# Altium schematic sheet 03_iMX 8X_PMIC.SchDoc
size A3; SheetNumber: 4; SheetTotal: 22
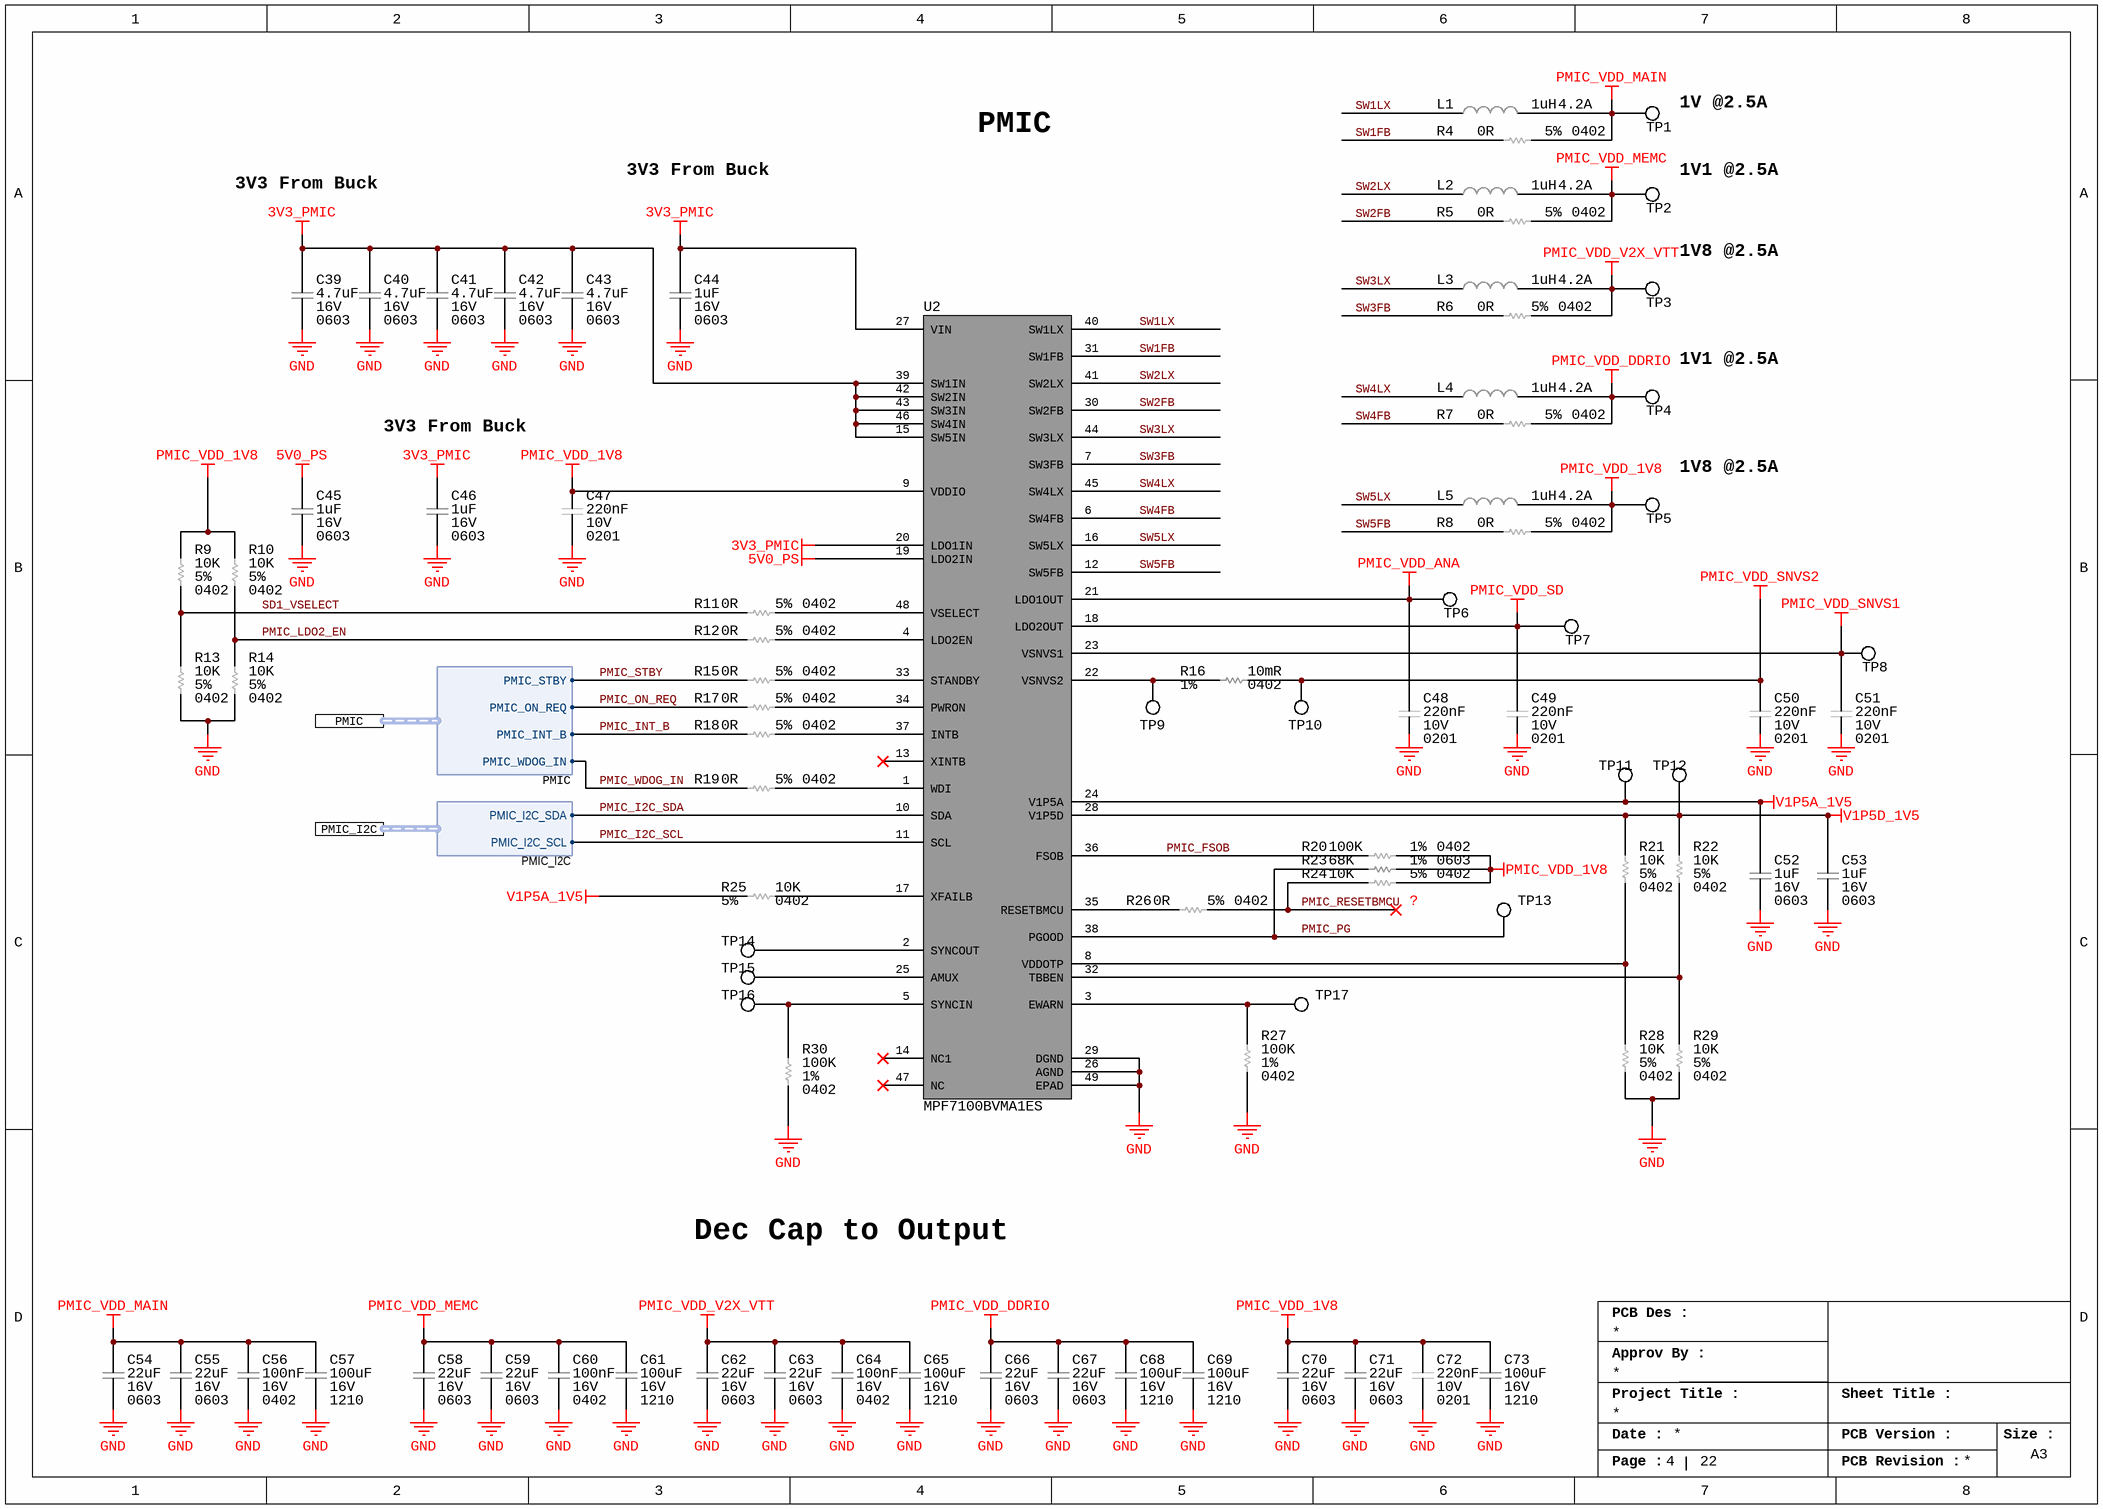
[diagram p0: 03_iMX 8X_PMIC.SchDoc]

## Parts
C39  Voltage: 16V  Capacitance: 4.7uF  Case/Package: 0603  [CAP_0603_CAPC1608X08N]  (hidden comment: CL10A475KO8NNNC)
C40  Voltage: 16V  Capacitance: 4.7uF  Case/Package: 0603  [CAP_0603_CAPC1608X08N]  (hidden comment: CL10A475KO8NNNC)
C41  Voltage: 16V  Capacitance: 4.7uF  Case/Package: 0603  [CAP_0603_CAPC1608X08N]  (hidden comment: CL10A475KO8NNNC)
C42  Voltage: 16V  Capacitance: 4.7uF  Case/Package: 0603  [CAP_0603_CAPC1608X08N]  (hidden comment: CL10A475KO8NNNC)
C43  Voltage: 16V  Capacitance: 4.7uF  Case/Package: 0603  [CAP_0603_CAPC1608X08N]  (hidden comment: CL10A475KO8NNNC)
C44  Voltage Rating: 16V  Capacitance: 1uF  Case/Package: 0603  [CAP_0603_CAPC1608X08N]  (hidden comment: CL10A105KO8NNNC)
C45  Voltage Rating: 16V  Capacitance: 1uF  Case/Package: 0603  [CAP_0603_CAPC1608X08N]  (hidden comment: CL10A105KO8NNNC)
C46  Voltage Rating: 16V  Capacitance: 1uF  Case/Package: 0603  [CAP_0603_CAPC1608X08N]  (hidden comment: CL10A105KO8NNNC)
C47  Voltage Rating (DC): 10V  Capacitance: 220nF  Case/Package: 0201  [CAP_0201_CAPC0603X03N]  (hidden comment: LMK063BJ224MP-F)
C48  Voltage Rating (DC): 10V  Capacitance: 220nF  Case/Package: 0201  [CAP_0201_CAPC0603X03N]  (hidden comment: LMK063BJ224MP-F)
C49  Voltage Rating (DC): 10V  Capacitance: 220nF  Case/Package: 0201  [CAP_0201_CAPC0603X03N]  (hidden comment: LMK063BJ224MP-F)
C50  Voltage Rating (DC): 10V  Capacitance: 220nF  Case/Package: 0201  [CAP_0201_CAPC0603X03N]  (hidden comment: LMK063BJ224MP-F)
C51  Voltage Rating (DC): 10V  Capacitance: 220nF  Case/Package: 0201  [CAP_0201_CAPC0603X03N]  (hidden comment: LMK063BJ224MP-F)
C52  Voltage Rating: 16V  Capacitance: 1uF  Case/Package: 0603  [CAP_0603_CAPC1608X08N]  (hidden comment: CL10A105KO8NNNC)
C53  Voltage Rating: 16V  Capacitance: 1uF  Case/Package: 0603  [CAP_0603_CAPC1608X08N]  (hidden comment: CL10A105KO8NNNC)
C54  Capacitance: 22uF  Voltage Rating: 16V  Case/Package: 0603  [CAP_0603_CAPC1608X08N]  (hidden comment: CL10A226MO7JZNC)
C55  Capacitance: 22uF  Voltage Rating: 16V  Case/Package: 0603  [CAP_0603_CAPC1608X08N]  (hidden comment: CL10A226MO7JZNC)
C56  Voltage Rating: 16V  Capacitance: 100nF  Case/Package: 0402  [CAP_0402_CAPC1005X05N]  (hidden comment: CL05B104KO5NNNC)
C57  Voltage Rating: 16V  Capacitance: 100uF  Case/Package: 1210  [CAP_1210_CAPC3225X270N]  (hidden comment: EMK325ABJ107MM-T)
C58  Capacitance: 22uF  Voltage Rating: 16V  Case/Package: 0603  [CAP_0603_CAPC1608X08N]  (hidden comment: CL10A226MO7JZNC)
C59  Capacitance: 22uF  Voltage Rating: 16V  Case/Package: 0603  [CAP_0603_CAPC1608X08N]  (hidden comment: CL10A226MO7JZNC)
C60  Voltage Rating: 16V  Capacitance: 100nF  Case/Package: 0402  [CAP_0402_CAPC1005X05N]  (hidden comment: CL05B104KO5NNNC)
C61  Voltage Rating: 16V  Capacitance: 100uF  Case/Package: 1210  [CAP_1210_CAPC3225X270N]  (hidden comment: EMK325ABJ107MM-T)
C62  Capacitance: 22uF  Voltage Rating: 16V  Case/Package: 0603  [CAP_0603_CAPC1608X08N]  (hidden comment: CL10A226MO7JZNC)
C63  Capacitance: 22uF  Voltage Rating: 16V  Case/Package: 0603  [CAP_0603_CAPC1608X08N]  (hidden comment: CL10A226MO7JZNC)
C64  Voltage Rating: 16V  Capacitance: 100nF  Case/Package: 0402  [CAP_0402_CAPC1005X05N]  (hidden comment: CL05B104KO5NNNC)
C65  Voltage Rating: 16V  Capacitance: 100uF  Case/Package: 1210  [CAP_1210_CAPC3225X270N]  (hidden comment: EMK325ABJ107MM-T)
C66  Capacitance: 22uF  Voltage Rating: 16V  Case/Package: 0603  [CAP_0603_CAPC1608X08N]  (hidden comment: CL10A226MO7JZNC)
C67  Capacitance: 22uF  Voltage Rating: 16V  Case/Package: 0603  [CAP_0603_CAPC1608X08N]  (hidden comment: CL10A226MO7JZNC)
C68  Voltage Rating: 16V  Capacitance: 100uF  Case/Package: 1210  [CAP_1210_CAPC3225X270N]  (hidden comment: EMK325ABJ107MM-T)
C69  Voltage Rating: 16V  Capacitance: 100uF  Case/Package: 1210  [CAP_1210_CAPC3225X270N]  (hidden comment: EMK325ABJ107MM-T)
C70  Capacitance: 22uF  Voltage Rating: 16V  Case/Package: 0603  [CAP_0603_CAPC1608X08N]  (hidden comment: CL10A226MO7JZNC)
C71  Capacitance: 22uF  Voltage Rating: 16V  Case/Package: 0603  [CAP_0603_CAPC1608X08N]  (hidden comment: CL10A226MO7JZNC)
C72  Voltage Rating (DC): 10V  Capacitance: 220nF  Case/Package: 0201  [CAP_0201_CAPC0603X03N]  (hidden comment: LMK063BJ224MP-F)
C73  Voltage Rating: 16V  Capacitance: 100uF  Case/Package: 1210  [CAP_1210_CAPC3225X270N]  (hidden comment: EMK325ABJ107MM-T)
L1  Saturation Current: 4.2A  Inductance: 1uH  [INDC2520X120N]  (hidden comment: TFM252012ALMA1R0MTAA)
L2  Saturation Current: 4.2A  Inductance: 1uH  [INDC2520X120N]  (hidden comment: TFM252012ALMA1R0MTAA)
L3  Saturation Current: 4.2A  Inductance: 1uH  [INDC2520X120N]  (hidden comment: TFM252012ALMA1R0MTAA)
L4  Saturation Current: 4.2A  Inductance: 1uH  [INDC2520X120N]  (hidden comment: TFM252012ALMA1R0MTAA)
L5  Saturation Current: 4.2A  Inductance: 1uH  [INDC2520X120N]  (hidden comment: TFM252012ALMA1R0MTAA)
R4  Case Code (Imperial): 0402  Tolerance: 5%  Resistance: 0R  [RES_0402_RESC1005X04N]  (hidden comment: ERJ-2GE0R00X)
R5  Case Code (Imperial): 0402  Tolerance: 5%  Resistance: 0R  [RES_0402_RESC1005X04N]  (hidden comment: ERJ-2GE0R00X)
R6  Case Code (Imperial): 0402  Tolerance: 5%  Resistance: 0R  [RES_0402_RESC1005X04N]  (hidden comment: ERJ-2GE0R00X)
R7  Case Code (Imperial): 0402  Tolerance: 5%  Resistance: 0R  [RES_0402_RESC1005X04N]  (hidden comment: ERJ-2GE0R00X)
R8  Case Code (Imperial): 0402  Tolerance: 5%  Resistance: 0R  [RES_0402_RESC1005X04N]  (hidden comment: ERJ-2GE0R00X)
R9  Tolerance: 5%  Resistance: 10K  Case/Package: 0402  [RES_0402_RESC1005X04N]  (hidden comment: ERJ-2GEJ103X)
R10  Tolerance: 5%  Resistance: 10K  Case/Package: 0402  [RES_0402_RESC1005X04N]  (hidden comment: ERJ-2GEJ103X)
R11  Case Code (Imperial): 0402  Tolerance: 5%  Resistance: 0R  [RES_0402_RESC1005X04N]  (hidden comment: ERJ-2GE0R00X)
R12  Case Code (Imperial): 0402  Tolerance: 5%  Resistance: 0R  [RES_0402_RESC1005X04N]  (hidden comment: ERJ-2GE0R00X)
R13  Tolerance: 5%  Resistance: 10K  Case/Package: 0402  [RES_0402_RESC1005X04N]  (hidden comment: ERJ-2GEJ103X)
R14  Tolerance: 5%  Resistance: 10K  Case/Package: 0402  [RES_0402_RESC1005X04N]  (hidden comment: ERJ-2GEJ103X)
R15  Case Code (Imperial): 0402  Tolerance: 5%  Resistance: 0R  [RES_0402_RESC1005X04N]  (hidden comment: ERJ-2GE0R00X)
R16  Tolerance: 1%  Resistance: 10mR  Case/Package: 0402  [RES_0603_RESC1608X04N]  (hidden comment: ERJ-2LWFR010X)
R17  Case Code (Imperial): 0402  Tolerance: 5%  Resistance: 0R  [RES_0402_RESC1005X04N]  (hidden comment: ERJ-2GE0R00X)
R18  Case Code (Imperial): 0402  Tolerance: 5%  Resistance: 0R  [RES_0402_RESC1005X04N]  (hidden comment: ERJ-2GE0R00X)
R19  Case Code (Imperial): 0402  Tolerance: 5%  Resistance: 0R  [RES_0402_RESC1005X04N]  (hidden comment: ERJ-2GE0R00X)
R20  Resistance: 100K  Tolerance: 1%  Case/Package: 0402  [RES_0402_RESC1005X04N]  (hidden comment: RC0402FR-07100KL)
R21  Tolerance: 5%  Resistance: 10K  Case/Package: 0402  [RES_0402_RESC1005X04N]  (hidden comment: ERJ-2GEJ103X)
R22  Tolerance: 5%  Resistance: 10K  Case/Package: 0402  [RES_0402_RESC1005X04N]  (hidden comment: ERJ-2GEJ103X)
R23  Tolerance: 1%  Resistance: 68K  Case/Package: 0603  [RES_0603_RESC1608X04N]  (hidden comment: RC0603FR-0768KL)
R24  Tolerance: 5%  Resistance: 10K  Case/Package: 0402  [RES_0402_RESC1005X04N]  (hidden comment: ERJ-2GEJ103X)
R25  Tolerance: 5%  Resistance: 10K  Case/Package: 0402  [RES_0402_RESC1005X04N]  (hidden comment: ERJ-2GEJ103X)
R26  Case Code (Imperial): 0402  Tolerance: 5%  Resistance: 0R  [RES_0402_RESC1005X04N]  (hidden comment: ERJ-2GE0R00X)
R27  Resistance: 100K  Tolerance: 1%  Case/Package: 0402  [RES_0402_RESC1005X04N]  (hidden comment: RC0402FR-07100KL)
R28  Tolerance: 5%  Resistance: 10K  Case/Package: 0402  [RES_0402_RESC1005X04N]  (hidden comment: ERJ-2GEJ103X)
R29  Tolerance: 5%  Resistance: 10K  Case/Package: 0402  [RES_0402_RESC1005X04N]  (hidden comment: ERJ-2GEJ103X)
R30  Resistance: 100K  Tolerance: 1%  Case/Package: 0402  [RES_0402_RESC1005X04N]  (hidden comment: RC0402FR-07100KL)
TP1  NO COMPONENT  [TP_PAD_0.5MM_SMD_ROUND]  (value not drawn)  (no BOM)
TP2  NO COMPONENT  [TP_PAD_0.5MM_SMD_ROUND]  (value not drawn)  (no BOM)
TP3  NO COMPONENT  [TP_PAD_0.5MM_SMD_ROUND]  (value not drawn)  (no BOM)
TP4  NO COMPONENT  [TP_PAD_0.5MM_SMD_ROUND]  (value not drawn)  (no BOM)
TP5  NO COMPONENT  [TP_PAD_0.5MM_SMD_ROUND]  (value not drawn)  (no BOM)
TP6  NO COMPONENT  [TP_PAD_0.5MM_SMD_ROUND]  (value not drawn)  (no BOM)
TP7  NO COMPONENT  [TP_PAD_0.5MM_SMD_ROUND]  (value not drawn)  (no BOM)
TP8  NO COMPONENT  [TP_PAD_0.5MM_SMD_ROUND]  (value not drawn)  (no BOM)
TP9  NO COMPONENT  [TP_PAD_0.5MM_SMD_ROUND]  (value not drawn)  (no BOM)
TP10  NO COMPONENT  [TP_PAD_0.5MM_SMD_ROUND]  (value not drawn)  (no BOM)
TP11  NO COMPONENT  [TP_PAD_0.5MM_SMD_ROUND]  (value not drawn)  (no BOM)
TP12  NO COMPONENT  [TP_PAD_0.5MM_SMD_ROUND]  (value not drawn)  (no BOM)
TP13  NO COMPONENT  [TP_PAD_0.5MM_SMD_ROUND]  (value not drawn)  (no BOM)
TP14  NO COMPONENT  [TP_PAD_0.5MM_SMD_ROUND]  (value not drawn)  (no BOM)
TP15  NO COMPONENT  [TP_PAD_0.5MM_SMD_ROUND]  (value not drawn)  (no BOM)
TP16  NO COMPONENT  [TP_PAD_0.5MM_SMD_ROUND]  (value not drawn)  (no BOM)
TP17  NO COMPONENT  [TP_PAD_0.5MM_SMD_ROUND]  (value not drawn)  (no BOM)
U2  MPF7100BVMA1ES  [HVQFN48_SOT619-27D_NXP]

## Ports
PMIC (harness PMIC), PMIC_I2C (harness PMIC_I2C)

## Harnesses
PMIC_I2C: PMIC_I2C_SDA, PMIC_I2C_SCL
PMIC: PMIC_ON_REQ, PMIC_STBY, PMIC_INT_B, PMIC_WDOG_IN

## Nets
3V3_PMIC: C39.2 C40.2 C41.2 C42.2 C43.2 C44.2 C46.2 U2.15(SW5IN) U2.20(LDO1IN) U2.27(VIN) U2.39(SW1IN) U2.42(SW2IN) U2.43(SW3IN) U2.46(SW4IN)
5V0_PS: C45.2 U2.19(LDO2IN)
GND: C39.1 C40.1 C41.1 C42.1 C43.1 C44.1 C45.1 C46.1 C47.1 C48.1 C49.1 C50.1 C51.1 C52.1 C53.1 C54.1 C55.1 C56.1 C57.1 C58.1 C59.1 C60.1 C61.1 C62.1 C63.1 C64.1 C65.1 C66.1 C67.1 C68.1 C69.1 C70.1 C71.1 C72.1 C73.1 R13.1 R14.1 R27.1 R28.1 R29.1 R30.1 U2.26(AGND) U2.29(DGND) U2.49(EPAD)
PMIC_VDD_1V8: C47.2 C70.2 C71.2 C72.2 C73.2 L5.2 R8.2 R9.2 R10.2 R20.1 R23.2 R24.1 TP5.1 U2.9(VDDIO)
PMIC_VDD_ANA: C48.2 TP6.1 U2.21(LDO1OUT)
PMIC_VDD_DDRIO: C66.2 C67.2 C68.2 C69.2 L4.2 R7.2 TP4.1
PMIC_VDD_MAIN: C54.2 C55.2 C56.2 C57.2 L1.2 R4.2 TP1.1
PMIC_VDD_MEMC: C58.2 C59.2 C60.2 C61.2 L2.2 R5.2 TP2.1
PMIC_VDD_SD: C49.2 TP7.1 U2.18(LDO2OUT)
PMIC_VDD_SNVS1: C51.2 TP8.1 U2.23(VSNVS1)
PMIC_VDD_SNVS2: C50.2 R16.2 TP10.1
PMIC_VDD_V2X_VTT: C62.2 C63.2 C64.2 C65.2 L3.2 R6.2 TP3.1
V1P5A_1V5: C52.2 R25.2 TP11.1 U2.24(V1P5A)
V1P5D_1V5: C53.2 R21.2 R22.2 TP12.1 U2.28(V1P5D)
PMIC_FSOB: R20.2 U2.36(FSOB)
PMIC_I2C_SCL: U2.11(SCL) ; port PMIC_I2C.PMIC_I2C_SCL
PMIC_I2C_SDA: U2.10(SDA) ; port PMIC_I2C.PMIC_I2C_SDA
PMIC_INT_B: R18.1 ; port PMIC.PMIC_INT_B
PMIC_LDO2_EN: R10.1 R12.1 R14.2
PMIC_ON_REQ: R17.1 ; port PMIC.PMIC_ON_REQ
PMIC_PG: R23.1 TP13.1 U2.38(PGOOD)
PMIC_RESETBMCU: R24.2 R26.2
PMIC_STBY: R15.1 ; port PMIC.PMIC_STBY
PMIC_WDOG_IN: R19.1 ; port PMIC.PMIC_WDOG_IN
SD1_VSELECT: R9.1 R11.1 R13.2
SW1FB: R4.1 U2.31(SW1FB)
SW1LX: L1.1 U2.40(SW1LX)
SW2FB: R5.1 U2.30(SW2FB)
SW2LX: L2.1 U2.41(SW2LX)
SW3FB: R6.1 U2.7(SW3FB)
SW3LX: L3.1 U2.44(SW3LX)
SW4FB: R7.1 U2.6(SW4FB)
SW4LX: L4.1 U2.45(SW4LX)
SW5FB: R8.1 U2.12(SW5FB)
SW5LX: L5.1 U2.16(SW5LX)
NetR11_2: R11.2 U2.48(VSELECT)
NetR12_2: R12.2 U2.4(LDO2EN)
NetR15_2: R15.2 U2.33(STANDBY)
NetR16_1: R16.1 TP9.1 U2.22(VSNVS2)
NetR17_2: R17.2 U2.34(PWRON)
NetR18_2: R18.2 U2.37(INTB)
NetR19_2: R19.2 U2.1(WDI)
NetR21_1: R21.1 R28.2 U2.8(VDDOTP)
NetR22_1: R22.1 R29.2 U2.32(TBBEN)
NetR25_1: R25.1 U2.17(XFAILB)
NetR26_1: R26.1 U2.35(RESETBMCU)
NetR27_2: R27.2 TP17.1 U2.3(EWARN)
NetR30_2: R30.2 TP16.1 U2.5(SYNCIN)
NetTP14_1: TP14.1 U2.2(SYNCOUT)
NetTP15_1: TP15.1 U2.25(AMUX)

Not connected (* = marked no-connect by the designer): U2 13(XINTB)* 14(NC1)* 47(NC)*

## Notes on the sheet
- (near TP1) 1V @2.5A
- 3V3 From Buck
- PMIC
- 1V1 @2.5A
- 1V8 @2.5A
- (near TP4) 1V1 @2.5A
- (near TP5) 1V8 @2.5A
- ?
- Dec Cap to Output
- PCB Des :
- Approv By :
- Project Title :
- Sheet Title :
- Date :
- PCB Version :
- Size :
- A3
- Page :
- PCB Revision :

## Library data of the parts
C39-C43 = CAP_4.7UF_16V_X5R_0603: CAP CER 4.7UF 16V X5R 0603; Manufacturer: Samsung; Material: Ceramic; Tolerance: 10%; Supplier 1: Digi-Key; Manufacturer Part Number: CL10A475KO8NNNC; RoHS: Yes; Category: Ceramic Capacitors; Stock 1: 1197540; Pricing 1: 1=0.12, 10=0.084, 50=0.0476, 100=0.0394, 500=0.02764, 1000=0.02288 (USD); Mount: Surface Mount; Case Code (Metric): 1608; Case Code (Imperial): 0603; Min Operating Temperature: -55°C; Max Operating Temperature: 85°C; Packaging: Tape and Reel; Voltage Rating: 16V; Dielectric: X5R; Series: CL; Construction: Flat; Length: 1.6mm; Height: 0.8mm; Depth: 0.8mm; Radiation Hardening: No; RoHS Compliant: Yes; ComponentLink1URL: https://datasheet.ciiva.com/25795/cl10a475ko8nnnc-25795890.pdf?src-supplier=Digi-Key; ComponentLink1Description: https://datasheet.ciiva.com/25795/cl10a475ko8nnnc-25795890.pdf?src-supplier=Digi-Key; ComponentLink2URL: https://datasheet.ciiva.com/26838/getdatasheetpartid-358619-26838383.pdf?src-supplier=Verical; ComponentLink2Description: https://datasheet.ciiva.com/26838/getdatasheetpartid-358619-26838383.pdf?src-supplier=Verical; ComponentLink3URL: https://datasheet.ciiva.com/29198/457663-da-01-en-vs-kondensator-0603-29198671.pdf?src-supplier=Conrad; ComponentLink3Description: https://datasheet.ciiva.com/29198/457663-da-01-en-vs-kondensator-0603-29198671.pdf?src-supplier=Conrad; Supplier Part Number 1: 1276-1784-1-ND
C44-C46 C52 C53 = CAP_1UF_16V_X5R_0603: CAP CER 1UF 16V X5R 0603; Manufacturer: Samsung; Material: Ceramic; Tolerance: 10%; Manufacturer Part Number: CL10A105KO8NNNC; RoHS: Yes; Category: Ceramic Capacitors; Stock 1: 252255; Pricing 1: 1=0.10000, 10=0.03300, 50=0.01800, 100=0.01470, 500=0.01050, 1000=0.00825 (USD); Mount: Surface Mount; Case Code (Metric): 1608; Case Code (Imperial): 0603; Contact Plating: Tin; Min Operating Temperature: -55°C; Max Operating Temperature: 85°C; Package Quantity: 1; Packaging: Tape and Reel; Dielectric: X5R; Voltage Rating (DC): 16V; Series: CL; Voltage: 16V; Construction: Flat; Length: 1.6mm; Width: 0.031inch; Height: 0.8mm; Thickness: 0.035inch; Depth: 0.8mm; Radiation Hardening: No; Lead Free: Lead Free; RoHS Compliant: Yes; ComponentLink1URL: https://datasheet.ciiva.com/16199/cl10a105ko8nnnc-16199033.pdf?src-supplier=Future+Electronics; ComponentLink1Description: https://datasheet.ciiva.com/16199/cl10a105ko8nnnc-16199033.pdf?src-supplier=Future+Electronics; ComponentLink2URL: https://datasheet.ciiva.com/15195/getdatasheetpartid-359688-15195706.pdf?src-supplier=Verical; ComponentLink2Description: https://datasheet.ciiva.com/15195/getdatasheetpartid-359688-15195706.pdf?src-supplier=Verical; ComponentLink3URL: https://datasheet.ciiva.com/29198/458190-da-01-en-vs-kondensator-0603-29198480.pdf?src-supplier=Conrad; ComponentLink3Description: https://datasheet.ciiva.com/29198/458190-da-01-en-vs-kondensator-0603-29198480.pdf?src-supplier=Conrad; Supplier 1: Digi-Key; Supplier 2: Mouser; Supplier 3: Newark; Supplier Part Number 1: 1276-1034-1-ND; Supplier Part Number 2: 187-CL10A105KO8NNNC; Supplier Part Number 3: 82AC9279
C47-C51 C72 = CAP_0.22UF_10V_X5R_0201: Multilayer Ceramic Capacitors (High dielectric type), 10V, 0.22 uF, ± 20 %, 0201, X5R, RoHS; Manufacturer: Taiyo Yuden; Material: 4241ConductorMaterial; Tolerance: 20%; Supplier 1: Digikey; Manufacturer Part Number: LMK063BJ224MP-F; RoHS: Yes; Category: Ceramic Capacitors; Stock 1: 6053224; Pricing 1: 1=0.12, 10=0.08, 50=0.0478, 100=0.0375, 500=0.02772, 1000=0.02295, 2500=0.02136, 5000=0.01954 (USD); Mount: Surface Mount; Case Code (Metric): 0603; Case Code (Imperial): 0201; Min Operating Temperature: -55°C; Max Operating Temperature: 85°C; Voltage Rating: 10V; Packaging: Tape and Reel; Package Quantity: 15000; Dielectric: X5R; Termination: SMD/SMT; Voltage: 10V; Series: M; Construction: Flat; Length: 0.6mm; Width: 0.3mm; Height: 0.3mm; Depth: 0.3mm; Radiation Hardening: No; Halogen Free: Halogen Free; RoHS Compliant: Yes; Reach SVHC Compliant: Unknown; ComponentLink1URL: https://datasheet.ciiva.com/134/lmk063bj224mp-f-ss-134995.pdf?src-supplier=Digikey; ComponentLink1Description: https://datasheet.ciiva.com/134/lmk063bj224mp-f-ss-134995.pdf?src-supplier=Digikey; ComponentLink2URL: https://datasheet.ciiva.com/11464/lmk063bj224mp-f-ss-11464053.pdf?src-supplier=Avnet; ComponentLink2Description: https://datasheet.ciiva.com/11464/lmk063bj224mp-f-ss-11464053.pdf?src-supplier=Avnet; ComponentLink3URL: https://datasheet.ciiva.com/15921/1589lmk063bj224mp-f-15921250.pdf?src-supplier=Onlinecomponents.com; ComponentLink3Description: https://datasheet.ciiva.com/15921/1589lmk063bj224mp-f-15921250.pdf?src-supplier=Onlinecomponents.com; ComponentLink4URL: https://datasheet.ciiva.com/26872/getdatasheetpartid-639019-26872592.pdf?src-supplier=Verical; ComponentLink4Description: https://datasheet.ciiva.com/26872/getdatasheetpartid-639019-26872592.pdf?src-supplier=Verical; ComponentLink5URL: https://datasheet.ciiva.com/30243/100lmk063bj224mp-f-30243150.pdf?src-supplier=Onlinecomponents.com; ComponentLink5Description: https://datasheet.ciiva.com/30243/100lmk063bj224mp-f-30243150.pdf?src-supplier=Onlinecomponents.com; ComponentLink6URL: https://datasheet.ciiva.com/28645/746258-28645141.pdf?src-supplier=Element14; ComponentLink6Description: https://datasheet.ciiva.com/28645/746258-28645141.pdf?src-supplier=Element14; ComponentLink7URL: https://datasheet.ciiva.com/5422/mlcc-all-e-541559-5422365.pdf?src-supplier=Mouser; ComponentLink7Description: https://datasheet.ciiva.com/5422/mlcc-all-e-541559-5422365.pdf?src-supplier=Mouser; Supplier Part Number 1: 587-2483-1-ND
C54 C55 C58 C59 C62 C63 C66 C67 C70 C71 = CAP_22UF_16V_X5R_0603: Cap Ceramic 22uF 16V X5R 20% Pad SMD 0603 85C T/R; Manufacturer: Samsung; Supplier 1: Digi-Key; Manufacturer Part Number: CL10A226MO7JZNC; RoHS: Yes; Category: Ceramic Capacitors; Stock 1: 1760065; Pricing 1: 1=0.59, 10=0.419, 50=0.3164, 100=0.2756, 500=0.20418, 1000=0.17355 (USD); Mount: Surface Mount; Case Code (Imperial): 0603; Case Code (Metric): 1608; Min Operating Temperature: -55°C; Max Operating Temperature: 85°C; Packaging: Cut Tape; Tolerance: 20%; Series: CL; RoHS Compliant: Yes; ComponentLink1URL: http://www.samsungsem.com/kr/support/product-search/mlcc/CL10A226MO7JZNC.jsp?src-supplier=Digi-Key; ComponentLink1Description: http://www.samsungsem.com/kr/support/product-search/mlcc/CL10A226MO7JZNC.jsp?src-supplier=Digi-Key; ComponentLink2URL: https://datasheet.octopart.com/CL10A226MO7JZNC-Samsung-Electro-Mechanics-datasheet-149156497.pdf?src-supplier=Future+Electronics; ComponentLink2Description: https://datasheet.octopart.com/CL10A226MO7JZNC-Samsung-Electro-Mechanics-datasheet-149156497.pdf?src-supplier=Future+Electronics; Supplier Part Number 1: 1276-7076-1-ND
C56 C60 C64 = CAP_100NF_16V_X7R_0402: Multilayer Ceramic Capacitor, 0.1 uF, 16 V, ± 10%, X7R, 0402 [1005 Metric]; Manufacturer: Samsung; Supplier 1: Digi-Key; Manufacturer Part Number: CL05B104KO5NNNC; RoHS: Yes; Category: Ceramic Capacitors; Stock 1: 11081064; Pricing 1: 1=0.1, 10=0.024, 50=0.013, 100=0.0105, 500=0.00752, 1000=0.00592, 2500=0.00538, 5000=0.00495 (USD); Mount: Surface Mount; Case Code (Metric): 1005; Case Code (Imperial): 0402; Material: Ceramic; Min Operating Temperature: -55°C; Max Operating Temperature: 125°C; Tolerance: 10%; Package Quantity: 1; Packaging: Tape and Reel; Dielectric: X7R; Series: CL; Voltage: 16V; Voltage Rating (DC): 16V; Construction: Flat; Length: 1mm; Width: 0.02inch; Height: 0.5mm; Thickness: 0.022inch; Depth: 0.5mm; Radiation Hardening: No; RoHS Compliant: Yes; Lead Free: Lead Free; ComponentLink1URL: https://datasheet.ciiva.com/26920/getdatasheetpartid-359683-26920169.pdf?src-supplier=Verical; ComponentLink1Description: https://datasheet.ciiva.com/26920/getdatasheetpartid-359683-26920169.pdf?src-supplier=Verical; ComponentLink2URL: https://datasheet.ciiva.com/29198/458718-da-01-en-vs-kondensator-0402-29198423.pdf?src-supplier=Conrad; ComponentLink2Description: https://datasheet.ciiva.com/29198/458718-da-01-en-vs-kondensator-0402-29198423.pdf?src-supplier=Conrad; ComponentLink3URL: https://datasheet.ciiva.com/16208/cl05b104kq5nnnc-16208343.pdf?src-supplier=Future+Electronics; ComponentLink3Description: https://datasheet.ciiva.com/16208/cl05b104kq5nnnc-16208343.pdf?src-supplier=Future+Electronics; ComponentLink4URL: https://datasheet.ciiva.com/26309/mlcc-catalogdownload2013-eng-26309003.pdf?src-supplier=Distrelec; ComponentLink4Description: https://datasheet.ciiva.com/26309/mlcc-catalogdownload2013-eng-26309003.pdf?src-supplier=Distrelec; Supplier Part Number 1: 1276-1001-6-ND
C57 C61 C65 C68 C69 C73 = CAP_100UF_16V_X5R_1210: Multilayer Ceramic Capacitor, 100 uF, 16 V, ± 20%, X5R, 1210 [3225 Metric]; Manufacturer: Taiyo Yuden; Material: 4241ConductorMaterial; Supplier 1: Digikey; Manufacturer Part Number: EMK325ABJ107MM-T; RoHS: Yes; Category: Ceramic Capacitors; Stock 1: 503358; Pricing 1: 1=1.73, 10=1.295, 50=1.1816, 100=0.9681 (USD); Mount: Surface Mount; Case Code (Metric): 3225; Case Code (Imperial): 1210; Min Operating Temperature: -55°C; Max Operating Temperature: 85°C; Tolerance: 20%; Packaging: Tape and Reel; Package Quantity: 500; Voltage Rating (DC): 16V; Dielectric: X5R; Termination: SMD/SMT; Series: M; Length: 3.2mm; Width: 2.5mm; Height: 2.5mm; Reach SVHC Compliant: No; RoHS Compliant: Yes; ComponentLink1URL: http://www.farnell.com/datasheets/1497285.pdf?src-supplier=Farnell; ComponentLink1Description: http://www.farnell.com/datasheets/1497285.pdf?src-supplier=Farnell; Supplier Part Number 1: 587-3152-1-ND
L1-L5 = IND_1uH_3.7A_TFM252012ALMA1R0MTAA: Inductor Power Shielded Thin Film 1uH 20% 1MHz Metal 3.7A 0.042Ohm DCR 1008 Automotive T/R; Manufacturer: TDK; DC Resistance (DCR): 42mR; Supplier 1: Digikey; Manufacturer Part Number: TFM252012ALMA1R0MTAA; RoHS: Yes; Category: Fixed Inductors; Stock 1: 21796; Pricing 1: 1=0.53, 10=0.432, 100=0.3551, 1000=0.29204, 3000=0.2714, 6000=0.25594, 9000=0.24732, 15000=0.23689, 21000=0.23026, 30000=0.22925 (USD); Mount: Surface Mount; Case/Package: 1008; Core Material: Metal; Case Code (Imperial): 1008; Case Code (Metric): 2520; Min Operating Temperature: -55°C; Max Operating Temperature: 150°C; Packaging: Cut Tape; Tolerance: 20%; Shielding: Shielded; Test Frequency: 1MHz; Series: TFM-ALMA; Resistance: 42mR; Length: 2.5mm; Width: 2mm; Ratings: AEC-Q200; RoHS Compliant: Yes; ComponentLink1URL: http://datasheet.octopart.com/TFM252012ALMA1R0MTAA-TDK-datasheet-151651383.pdf?src-supplier=Avnet; ComponentLink1Description: http://datasheet.octopart.com/TFM252012ALMA1R0MTAA-TDK-datasheet-151651383.pdf?src-supplier=Avnet; ComponentLink2URL: http://datasheet.octopart.com/TFM252012ALMA1R0MTAA-TDK-datasheet-151651383.pdf?src-supplier=Mouser; ComponentLink2Description: http://datasheet.octopart.com/TFM252012ALMA1R0MTAA-TDK-datasheet-151651383.pdf?src-supplier=Mouser; ComponentLink3URL: http://datasheet.octopart.com/TFM252012ALMA1R0MTAA-TDK-datasheet-151651383.pdf?src-supplier=Arrow+Electronics; ComponentLink3Description: http://datasheet.octopart.com/TFM252012ALMA1R0MTAA-TDK-datasheet-151651383.pdf?src-supplier=Arrow+Electronics; ComponentLink4URL: http://datasheet.octopart.com/TFM252012ALMA1R0MTAA-TDK-datasheet-151651383.pdf?src-supplier=Farnell; ComponentLink4Description: http://datasheet.octopart.com/TFM252012ALMA1R0MTAA-TDK-datasheet-151651383.pdf?src-supplier=Farnell; ComponentLink5URL: http://datasheet.octopart.com/TFM252012ALMA1R0MTAA-TDK-datasheet-151651383.pdf?src-supplier=Digikey; ComponentLink5Description: http://datasheet.octopart.com/TFM252012ALMA1R0MTAA-TDK-datasheet-151651383.pdf?src-supplier=Digikey; ComponentLink6URL: https://product.tdk.com/info/en/catalog/datasheets/inductor_automotive_power_tfm252012alma_en.pdf?src-supplier=Digikey; ComponentLink6Description: https://product.tdk.com/info/en/catalog/datasheets/inductor_automotive_power_tfm252012alma_en.pdf?src-supplier=Digikey; ComponentLink7URL: http://datasheet.octopart.com/TFM252012ALMA1R0MTAA-TDK-datasheet-151651383.pdf?src-supplier=Verical; ComponentLink7Description: http://datasheet.octopart.com/TFM252012ALMA1R0MTAA-TDK-datasheet-151651383.pdf?src-supplier=Verical; ComponentLink8URL: http://datasheet.octopart.com/TFM252012ALMA1R0MTAA-TDK-datasheet-151651383.pdf?src-supplier=Newark; ComponentLink8Description: http://datasheet.octopart.com/TFM252012ALMA1R0MTAA-TDK-datasheet-151651383.pdf?src-supplier=Newark; ComponentLink9URL: https://datasheet.octopart.com/TFM252012ALMA1R0MTAA-TDK-datasheet-137163437.pdf?src-supplier=Future+Electronics; ComponentLink9Description: https://datasheet.octopart.com/TFM252012ALMA1R0MTAA-TDK-datasheet-137163437.pdf?src-supplier=Future+Electronics; ComponentLink10URL: http://datasheet.octopart.com/TFM252012ALMA1R0MTAA-TDK-datasheet-151651383.pdf?src-supplier=TTI; ComponentLink10Description: http://datasheet.octopart.com/TFM252012ALMA1R0MTAA-TDK-datasheet-151651383.pdf?src-supplier=TTI; Supplier Part Number 1: 445-175183-1-ND
R4-R8 R11 R12 R15 R17-R19 R26 = RES_0R_5%_100mW_0402: SMD Chip Resistor, Jumper, 0 ohm, 100 mW, 0402 [1005 Metric], Thick Film, General Purpose; Manufacturer: Panasonic; Power Rating: 100mW; Voltage Rating: 50V; Temperature Coefficient: 600ppm/°C; Supplier 1: Mouser; Manufacturer Part Number: ERJ-2GE0R00X; RoHS: Yes; Category: Chip SMD Resistors; Stock 1: 10989354; Pricing 1: 1=0.1, 10=0.013, 50=0.013, 100=0.006, 1000=0.004, 2500=0.003, 10000=0.003 (USD); Mount: Surface Mount; Case/Package: 0402; Contact Plating: Tin; Case Code (Metric): 1005; Size Code: 0402; Min Operating Temperature: -55°C; Max Operating Temperature: 155°C; Resistor Type: Thick Film; Packaging: Cut Tape; Package Quantity: 10000; Number of Terminations: 2; Termination: SMD/SMT; Max Power Dissipation: 100mW; Voltage Rating (DC): 50V; Features: Automotive AEC-Q200; Series: ERJ; Construction: Rectangular; Technology: THICK FILM; Length: 1mm; Width: 0.5mm; Height: 0.35mm; Depth: 0.5mm; Ratings: AEC-Q200; Radiation Hardening: No; Reach SVHC Compliant: No; Military Standard: Not; Lead Free: Lead Free; RoHS Compliant: Yes; ComponentLink1URL: https://datasheet.ciiva.com/11821/0900766b80f806dd-11821176.pdf?src-supplier=Rs; ComponentLink1Description: https://datasheet.ciiva.com/11821/0900766b80f806dd-11821176.pdf?src-supplier=Rs; ComponentLink2URL: https://datasheet.ciiva.com/43460/1678796-43460347.pdf?src-supplier=Farnell; ComponentLink2Description: https://datasheet.ciiva.com/43460/1678796-43460347.pdf?src-supplier=Farnell; ComponentLink3URL: https://datasheet.ciiva.com/46389/1678796-46389518.pdf?src-supplier=Element14; ComponentLink3Description: https://datasheet.ciiva.com/46389/1678796-46389518.pdf?src-supplier=Element14; ComponentLink4URL: https://datasheet.ciiva.com/5959/1678796-5959692.pdf?src-supplier=Farnell; ComponentLink4Description: https://datasheet.ciiva.com/5959/1678796-5959692.pdf?src-supplier=Farnell; ComponentLink5URL: https://datasheet.ciiva.com/28695/1678796-28695758.pdf?src-supplier=Element14; ComponentLink5Description: https://datasheet.ciiva.com/28695/1678796-28695758.pdf?src-supplier=Element14; ComponentLink6URL: https://datasheet.ciiva.com/16783/70260739-16783734.pdf?src-supplier=Allied+Electronics; ComponentLink6Description: https://datasheet.ciiva.com/16783/70260739-16783734.pdf?src-supplier=Allied+Electronics; ComponentLink7URL: https://datasheet.ciiva.com/16778/70260739-16778335.pdf?src-supplier=Allied+Electronics; ComponentLink7Description: https://datasheet.ciiva.com/16778/70260739-16778335.pdf?src-supplier=Allied+Electronics; ComponentLink8URL: https://datasheet.ciiva.com/48531/aoa0000ce1-48531077.pdf?src-supplier=Avnet; ComponentLink8Description: https://datasheet.ciiva.com/48531/aoa0000ce1-48531077.pdf?src-supplier=Avnet; ComponentLink9URL: https://datasheet.ciiva.com/30097/4aoa0000ce1-30097116.pdf?src-supplier=Onlinecomponents.com; ComponentLink9Description: https://datasheet.ciiva.com/30097/4aoa0000ce1-30097116.pdf?src-supplier=Onlinecomponents.com; Supplier Part Number 1: 667-ERJ-2GE0R00X
R9 R10 R13 R14 R21 R22 R24 R25 R28 R29 = RES_10K_5%_100mW_0402: Res Thick Film 0402 10K Ohm 5% 1/10W ±200ppm/°C Molded SMD Punched Carrier T/R; Manufacturer: Panasonic; Power Rating: 100mW; Voltage Rating: 50V; Supplier 1: Digi-Key; Manufacturer Part Number: ERJ-2GEJ103X; RoHS: Yes; Category: Chip SMD Resistors; Stock 1: 4696986; Pricing 1: 1=0.1, 10=0.021, 50=0.0132, 100=0.011, 500=0.00744, 1000=0.00639, 5000=0.00464 (USD); Mount: Surface Mount; Contact Plating: Tin; Case Code (Metric): 1005; Case Code (Imperial): 0402; Size Code: 0402; Min Operating Temperature: -55°C; Max Operating Temperature: 155°C; Temperature Coefficient: 200ppm/°C; Packaging: Cut Tape; Resistor Type: Thick Film; Package Quantity: 10000; Number of Terminations: 2; Termination: SMD/SMT; Max Power Dissipation: 100mW; Features: Automotive AEC-Q200; Series: ERJ; Resistance Tolerance: 5%; Technology: THICK FILM; Voltage Rating (DC): 50V; Length: 1mm; Width: 0.5mm; Height: 0.35mm; Depth: 0.5mm; Ratings: AEC-Q200; Radiation Hardening: No; Reach SVHC Compliant: No; RoHS Compliant: Yes; Lead Free: 5697LeadFree; ComponentLink1URL: https://datasheet.ciiva.com/27055/1935721-27055112.pdf?src-supplier=Jameco; ComponentLink1Description: https://datasheet.ciiva.com/27055/1935721-27055112.pdf?src-supplier=Jameco; ComponentLink2URL: https://datasheet.ciiva.com/11821/0900766b80f806dd-11821170.pdf?src-supplier=Rs; ComponentLink2Description: https://datasheet.ciiva.com/11821/0900766b80f806dd-11821170.pdf?src-supplier=Rs; ComponentLink3URL: https://datasheet.ciiva.com/43460/1678796-43460391.pdf?src-supplier=Farnell; ComponentLink3Description: https://datasheet.ciiva.com/43460/1678796-43460391.pdf?src-supplier=Farnell; ComponentLink4URL: https://datasheet.ciiva.com/22785/1678796-22785949.pdf?src-supplier=Farnell; ComponentLink4Description: https://datasheet.ciiva.com/22785/1678796-22785949.pdf?src-supplier=Farnell; ComponentLink5URL: https://datasheet.ciiva.com/46371/1678796-46371910.pdf?src-supplier=Element14; ComponentLink5Description: https://datasheet.ciiva.com/46371/1678796-46371910.pdf?src-supplier=Element14; ComponentLink6URL: https://datasheet.ciiva.com/28514/1678796-28514154.pdf?src-supplier=Element14; ComponentLink6Description: https://datasheet.ciiva.com/28514/1678796-28514154.pdf?src-supplier=Element14; ComponentLink7URL: https://datasheet.ciiva.com/24070/aoa0000ce1-37422-24070679.pdf?src-supplier=Mouser; ComponentLink7Description: https://datasheet.ciiva.com/24070/aoa0000ce1-37422-24070679.pdf?src-supplier=Mouser; ComponentLink8URL: https://datasheet.ciiva.com/16767/70260739-16767130.pdf?src-supplier=Allied+Electronics; ComponentLink8Description: https://datasheet.ciiva.com/16767/70260739-16767130.pdf?src-supplier=Allied+Electronics; ComponentLink9URL: https://datasheet.ciiva.com/16774/70260739-16774504.pdf?src-supplier=Allied+Electronics; ComponentLink9Description: https://datasheet.ciiva.com/16774/70260739-16774504.pdf?src-supplier=Allied+Electronics; ComponentLink10URL: https://datasheet.ciiva.com/9194/aoa0000ce1-9194140.pdf?src-supplier=Avnet; ComponentLink10Description: https://datasheet.ciiva.com/9194/aoa0000ce1-9194140.pdf?src-supplier=Avnet; Supplier Part Number 1: P10KJCT-ND
R16 = RES_10mR_1%_0.05W_0402: Res Current Sense Thick Film 0402 0.01 Ohm 1% 1/5W 0ppm/°C to 500ppm/°C Molded T/R; Manufacturer: Panasonic; Max Power Dissipation: 200mW; Supplier 1: Mouser; Manufacturer Part Number: ERJ-2LWFR010X; RoHS: Yes; Category: Chip SMD Resistors; Stock 1: 52793; Pricing 1: 1=0.24, 10=0.144, 50=0.13, 100=0.098, 500=0.08, 1000=0.071, 5000=0.061, 10000=0.056, 30000=0.056 (USD); Case Code (Metric): 1005; Case Code (Imperial): 0402; Min Operating Temperature: -55°C; Max Operating Temperature: 125°C; Packaging: Cut Tape; Temperature Coefficient: 500ppm/°C; Number of Terminations: 2; Features: Automotive AEC-Q200; Series: ERJ; Length: 0.039inch; Width: 0.02inch; Height: 0.018inch; RoHS Compliant: Yes; ComponentLink1URL: http://industrial.panasonic.com/cdbs/www-data/pdf/RDN0000/AOA0000C313.pdf?src-supplier=Farnell; ComponentLink1Description: http://industrial.panasonic.com/cdbs/www-data/pdf/RDN0000/AOA0000C313.pdf?src-supplier=Farnell; ComponentLink2URL: https://industrial.panasonic.com/cdbs/www-data/pdf/RDN0000/AOA0000C313.pdf?src-supplier=Digikey; ComponentLink2Description: https://industrial.panasonic.com/cdbs/www-data/pdf/RDN0000/AOA0000C313.pdf?src-supplier=Digikey; ComponentLink3URL: http://industrial.panasonic.com/cdbs/www-data/pdf/RDN0000/AOA0000C313.pdf?src-supplier=Element14; ComponentLink3Description: http://industrial.panasonic.com/cdbs/www-data/pdf/RDN0000/AOA0000C313.pdf?src-supplier=Element14; ComponentLink4URL: https://datasheet.octopart.com/ERJ2LWFR010X-Panasonic-datasheet-68299093.pdf?src-supplier=Future+Electronics; ComponentLink4Description: https://datasheet.octopart.com/ERJ2LWFR010X-Panasonic-datasheet-68299093.pdf?src-supplier=Future+Electronics; ComponentLink5URL: https://datasheet.octopart.com/ERJ2LWFR010X-Panasonic-datasheet-136473239.pdf?src-supplier=Newark; ComponentLink5Description: https://datasheet.octopart.com/ERJ2LWFR010X-Panasonic-datasheet-136473239.pdf?src-supplier=Newark; ComponentLink6URL: http://industrial.panasonic.com/cdbs/www-data/pdf/RDN0000/AOA0000C313.pdf?src-supplier=Newark; ComponentLink6Description: http://industrial.panasonic.com/cdbs/www-data/pdf/RDN0000/AOA0000C313.pdf?src-supplier=Newark; Supplier Part Number 1: 667-ERJ-2LWFR010X
R20 R27 R30 = RES_100K_1%_100mW_0402: SMD Chip Resistor, 100 kOhm, ± 1%, 63 mW, 0402 [1005 Metric], Thick Film, General Purpose; Manufacturer: Yageo; Temperature Coefficient: 100ppm/°C; Power Rating: 63mW; Voltage Rating: 50V; Supplier 1: Digi-Key; Manufacturer Part Number: RC0402FR-07100KL; RoHS: Yes; Category: Chip SMD Resistors; Stock 1: 27579413; Pricing 1: 1=0.1, 10=0.014, 50=0.0084, 100=0.007, 500=0.00464, 1000=0.00396, 5000=0.00282 (USD); Case Code (Metric): 1005; Case Code (Imperial): 0402; Min Operating Temperature: -55°C; Max Operating Temperature: 155°C; Resistor Type: Thick Film; Packaging: Tape and Reel; Package Quantity: 1; Number of Terminations: 2; Termination: SMD/SMT; Max Power Dissipation: 63mW; Features: Moisture Resistant; Series: RC; Resistance Tolerance: 1%; Construction: Rectangular; Technology: THICK FILM; Voltage Rating (AC): 50V; Length: 0.039inch; Width: 0.02inch; Height: 0.016inch; Depth: 0.5mm; Reach SVHC Compliant: No; RoHS Compliant: Yes; Lead Free: 5697LeadFree; Military Standard: Not; ComponentLink1URL: https://datasheet.ciiva.com/11819/0900766b80c66297-11819452.pdf?src-supplier=Rs; ComponentLink1Description: https://datasheet.ciiva.com/11819/0900766b80c66297-11819452.pdf?src-supplier=Rs; ComponentLink2URL: https://datasheet.ciiva.com/22747/1018594-22747509.pdf?src-supplier=Element14; ComponentLink2Description: https://datasheet.ciiva.com/22747/1018594-22747509.pdf?src-supplier=Element14; ComponentLink3URL: https://datasheet.ciiva.com/2453/pyu-r-int-thick-7-2453362.pdf?src-supplier=Digi-Key; ComponentLink3Description: https://datasheet.ciiva.com/2453/pyu-r-int-thick-7-2453362.pdf?src-supplier=Digi-Key; ComponentLink4URL: https://datasheet.ciiva.com/12667/pyu-rc0402-51-rohs-l-6-r-12667930.pdf?src-supplier=Mouser; ComponentLink4Description: https://datasheet.ciiva.com/12667/pyu-rc0402-51-rohs-l-6-r-12667930.pdf?src-supplier=Mouser; ComponentLink5URL: https://datasheet.ciiva.com/15189/getdatasheetpartid-323696-15189334.pdf?src-supplier=Verical; ComponentLink5Description: https://datasheet.ciiva.com/15189/getdatasheetpartid-323696-15189334.pdf?src-supplier=Verical; ComponentLink6URL: https://datasheet.ciiva.com/2453/pyu-r-int-thick-7-2453363.pdf?src-supplier=Digi-Key; ComponentLink6Description: https://datasheet.ciiva.com/2453/pyu-r-int-thick-7-2453363.pdf?src-supplier=Digi-Key; ComponentLink7URL: https://datasheet.ciiva.com/2453/pyu-r-int-thick-7-2453361.pdf?src-supplier=Digi-Key; ComponentLink7Description: https://datasheet.ciiva.com/2453/pyu-r-int-thick-7-2453361.pdf?src-supplier=Digi-Key; Supplier Part Number 1: 311-100KLRCT-ND
R23 = RES_68K_1%_100mW_0603: SMD Chip Resistor, 68 kOhm, ± 1%, 100 mW, 0603 [1608 Metric], Thick Film, General Purpose; Manufacturer: Yageo; Power Rating: 100mW; Voltage Rating: 50V; Temperature Coefficient: 100ppm/°C; Supplier 1: Digikey; Manufacturer Part Number: RC0603FR-0768KL; RoHS: Yes; Category: Chip SMD Resistors; Stock 1: 465324; Pricing 1: 1=0.1, 10=0.012, 50=0.0096, 100=0.0071, 500=0.00662, 1000=0.00612 (USD); Number of Pins: 2; Case Code (Metric): 1608; Case Code (Imperial): 0603; Size Code: 0603; Min Operating Temperature: -55°C; Max Operating Temperature: 155°C; Package Quantity: 1; Packaging: Tape and Reel; Voltage Rating (DC): 50V; Resistor Type: Thick Film; Number of Terminations: 2; Termination: SMD/SMT; Max Power Dissipation: 100mW; Features: Moisture Resistant; Series: RC; Resistance Tolerance: 1%; Technology: THICK FILM; Voltage Rating (AC): 50V; Length: 0.063inch; Width: 0.031inch; Height: 0.022inch; Depth: 0.8mm; Reach SVHC Compliant: No; Lead Free: Lead Free; RoHS Compliant: Yes; ComponentLink1URL: https://datasheet.ciiva.com/11819/0900766b80f96399-11819412.pdf?src-supplier=Rs; ComponentLink1Description: https://datasheet.ciiva.com/11819/0900766b80f96399-11819412.pdf?src-supplier=Rs; ComponentLink2URL: https://datasheet.ciiva.com/2454/pyu-r-int-thick-7-2454147.pdf?src-supplier=Digikey; ComponentLink2Description: https://datasheet.ciiva.com/2454/pyu-r-int-thick-7-2454147.pdf?src-supplier=Digikey; ComponentLink3URL: https://datasheet.ciiva.com/2454/pyu-r-int-thick-7-2454148.pdf?src-supplier=Digikey; ComponentLink3Description: https://datasheet.ciiva.com/2454/pyu-r-int-thick-7-2454148.pdf?src-supplier=Digikey; ComponentLink4URL: https://datasheet.ciiva.com/2454/pyu-r-int-thick-7-2454149.pdf?src-supplier=Digikey; ComponentLink4Description: https://datasheet.ciiva.com/2454/pyu-r-int-thick-7-2454149.pdf?src-supplier=Digikey; ComponentLink5URL: https://datasheet.ciiva.com/7983/443971-7983658.pdf?src-supplier=Element14; ComponentLink5Description: https://datasheet.ciiva.com/7983/443971-7983658.pdf?src-supplier=Element14; ComponentLink6URL: https://datasheet.ciiva.com/46412/443971-46412855.pdf?src-supplier=Element14; ComponentLink6Description: https://datasheet.ciiva.com/46412/443971-46412855.pdf?src-supplier=Element14; ComponentLink7URL: https://datasheet.ciiva.com/7746/443971-7746390.pdf?src-supplier=Element14; ComponentLink7Description: https://datasheet.ciiva.com/7746/443971-7746390.pdf?src-supplier=Element14; ComponentLink8URL: https://datasheet.ciiva.com/7746/443971-7746391.pdf?src-supplier=Element14; ComponentLink8Description: https://datasheet.ciiva.com/7746/443971-7746391.pdf?src-supplier=Element14; Supplier Part Number 1: 311-68.0KHRCT-ND
TP1-TP17 = TP_PAD_SMD_SMALL: Test Point, SMD pad, round, 1.5mm, 1.6mm, 3mm diameter
U2 = IC_PMIC_IMX8_MPF7100BVMA1ES: PMIC, i.MX8, 5 buck, 2 LDO RoHS Compliant: Yes; Manufacturer: NXP Semiconductors; Supplier 1: Digikey; Manufacturer Part Number: MPF7100BVMA1ES; RoHS: No; Stock 1: 35; Pricing 1: 1=6.33, 10=4.898, 25=4.54, 100=4.2552 (USD); Supplier Part Number 1: 568-MPF7100BVMA1ES-ND